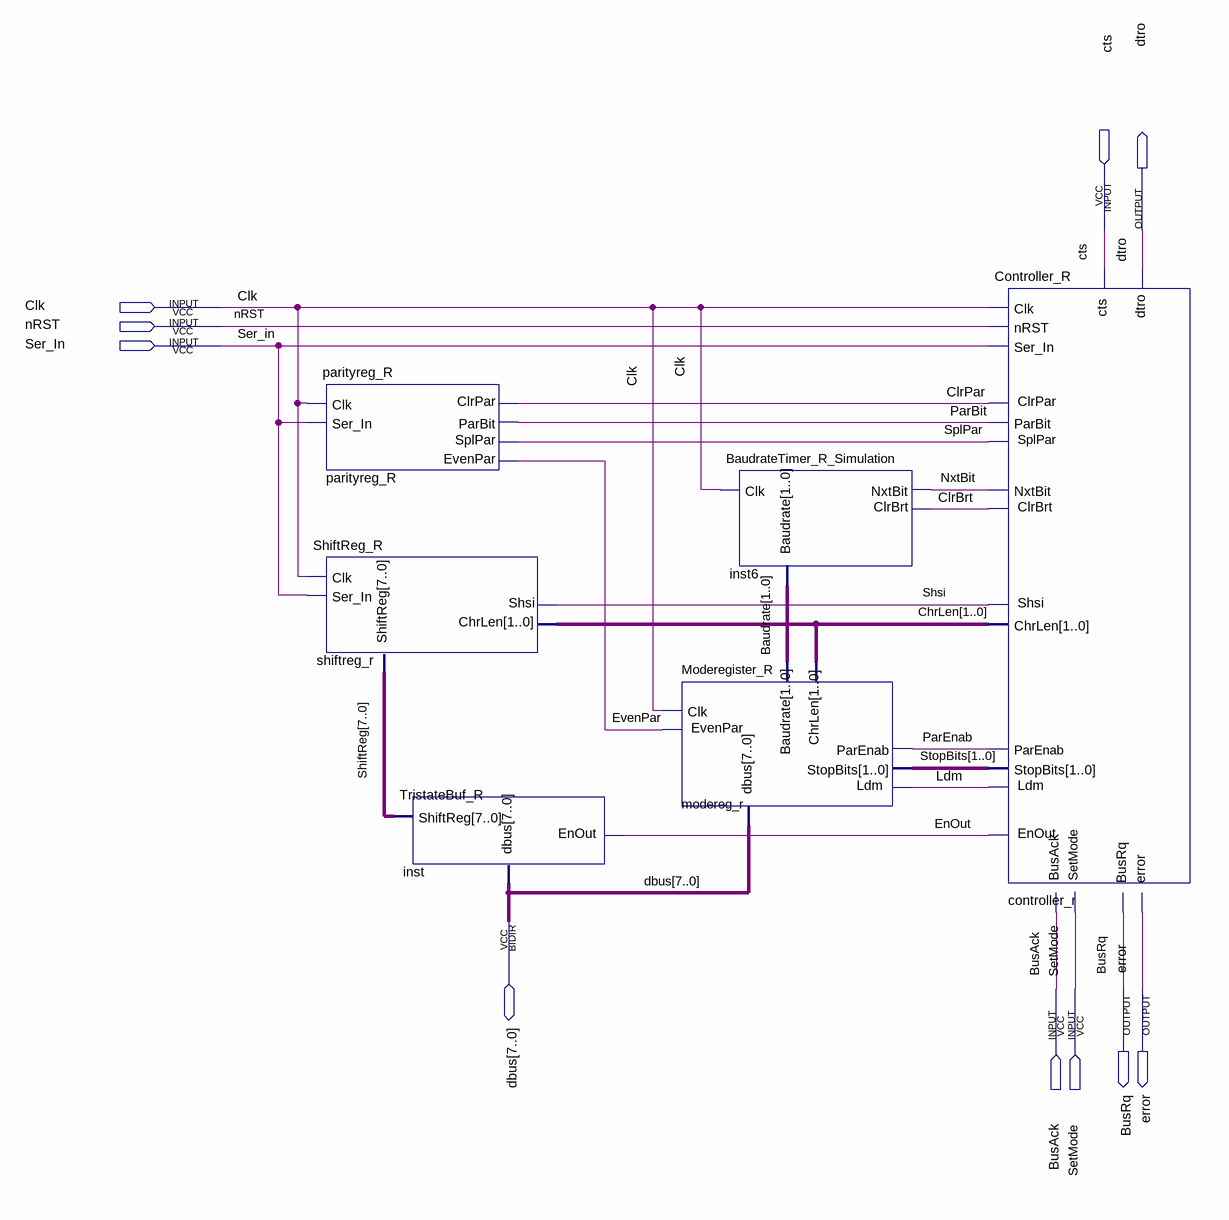
[diagram p0: schematic sheet]
// Quartus schematic Ser2Par_Simulation.bdf as structural Verilog: 6 symbols, 10 pins
module Ser2Par_Simulation (
  input  cts,
  input  Clk,
  input  nRST,
  input  Ser_In,
  input  BusAck,
  input  SetMode,
  inout  [7:0] dbus,
  output dtro,
  output BusRq,
  output error
);

  wire ClrBrt, ClrPar, EnOut, EvenPar, Ldm, NxtBit, ParBit, ParEnab, Shsi, SplPar;
  wire [1:0] Baudrate, ChrLen, StopBits;
  wire [7:0] ShiftReg;

  parityreg_R parityreg_R (
    .Clk(Clk), .ClrPar(ClrPar), .EvenPar(EvenPar), .Ser_In(Ser_In), .SplPar(SplPar), .ParBit(ParBit));
  ShiftReg_R shiftreg_r (.ChrLen(ChrLen), .Clk(Clk), .Ser_In(Ser_In), .Shsi(Shsi), .ShiftReg(ShiftReg));
  TristateBuf_R inst (.EnOut(EnOut), .ShiftReg(ShiftReg), .dbus(dbus));
  Moderegister_R modereg_r (
    .Clk(Clk), .Ldm(Ldm), .dbus(dbus), .Baudrate(Baudrate), .ChrLen(ChrLen), .EvenPar(EvenPar),
    .ParEnab(ParEnab), .StopBits(StopBits));
  BaudrateTimer_R_Simulation inst6 (.Baudrate(Baudrate), .Clk(Clk), .ClrBrt(ClrBrt), .NxtBit(NxtBit));
  Controller_R controller_r (
    .BusAck(BusAck), .ChrLen(ChrLen), .Clk(Clk), .NxtBit(NxtBit), .ParBit(ParBit), .ParEnab(ParEnab),
    .Ser_In(Ser_In), .SetMode(SetMode), .StopBits(StopBits), .cts(cts), .nRST(nRST), .BusRq(BusRq),
    .ClrBrt(ClrBrt), .ClrPar(ClrPar), .EnOut(EnOut), .Ldm(Ldm), .Shsi(Shsi), .SplPar(SplPar), .dtro(dtro),
    .error(error));
endmodule
